# EAGLE design DCDCHalfBridgeFinished (EAGLE 7.5.0)

## Sheet 1 of 2
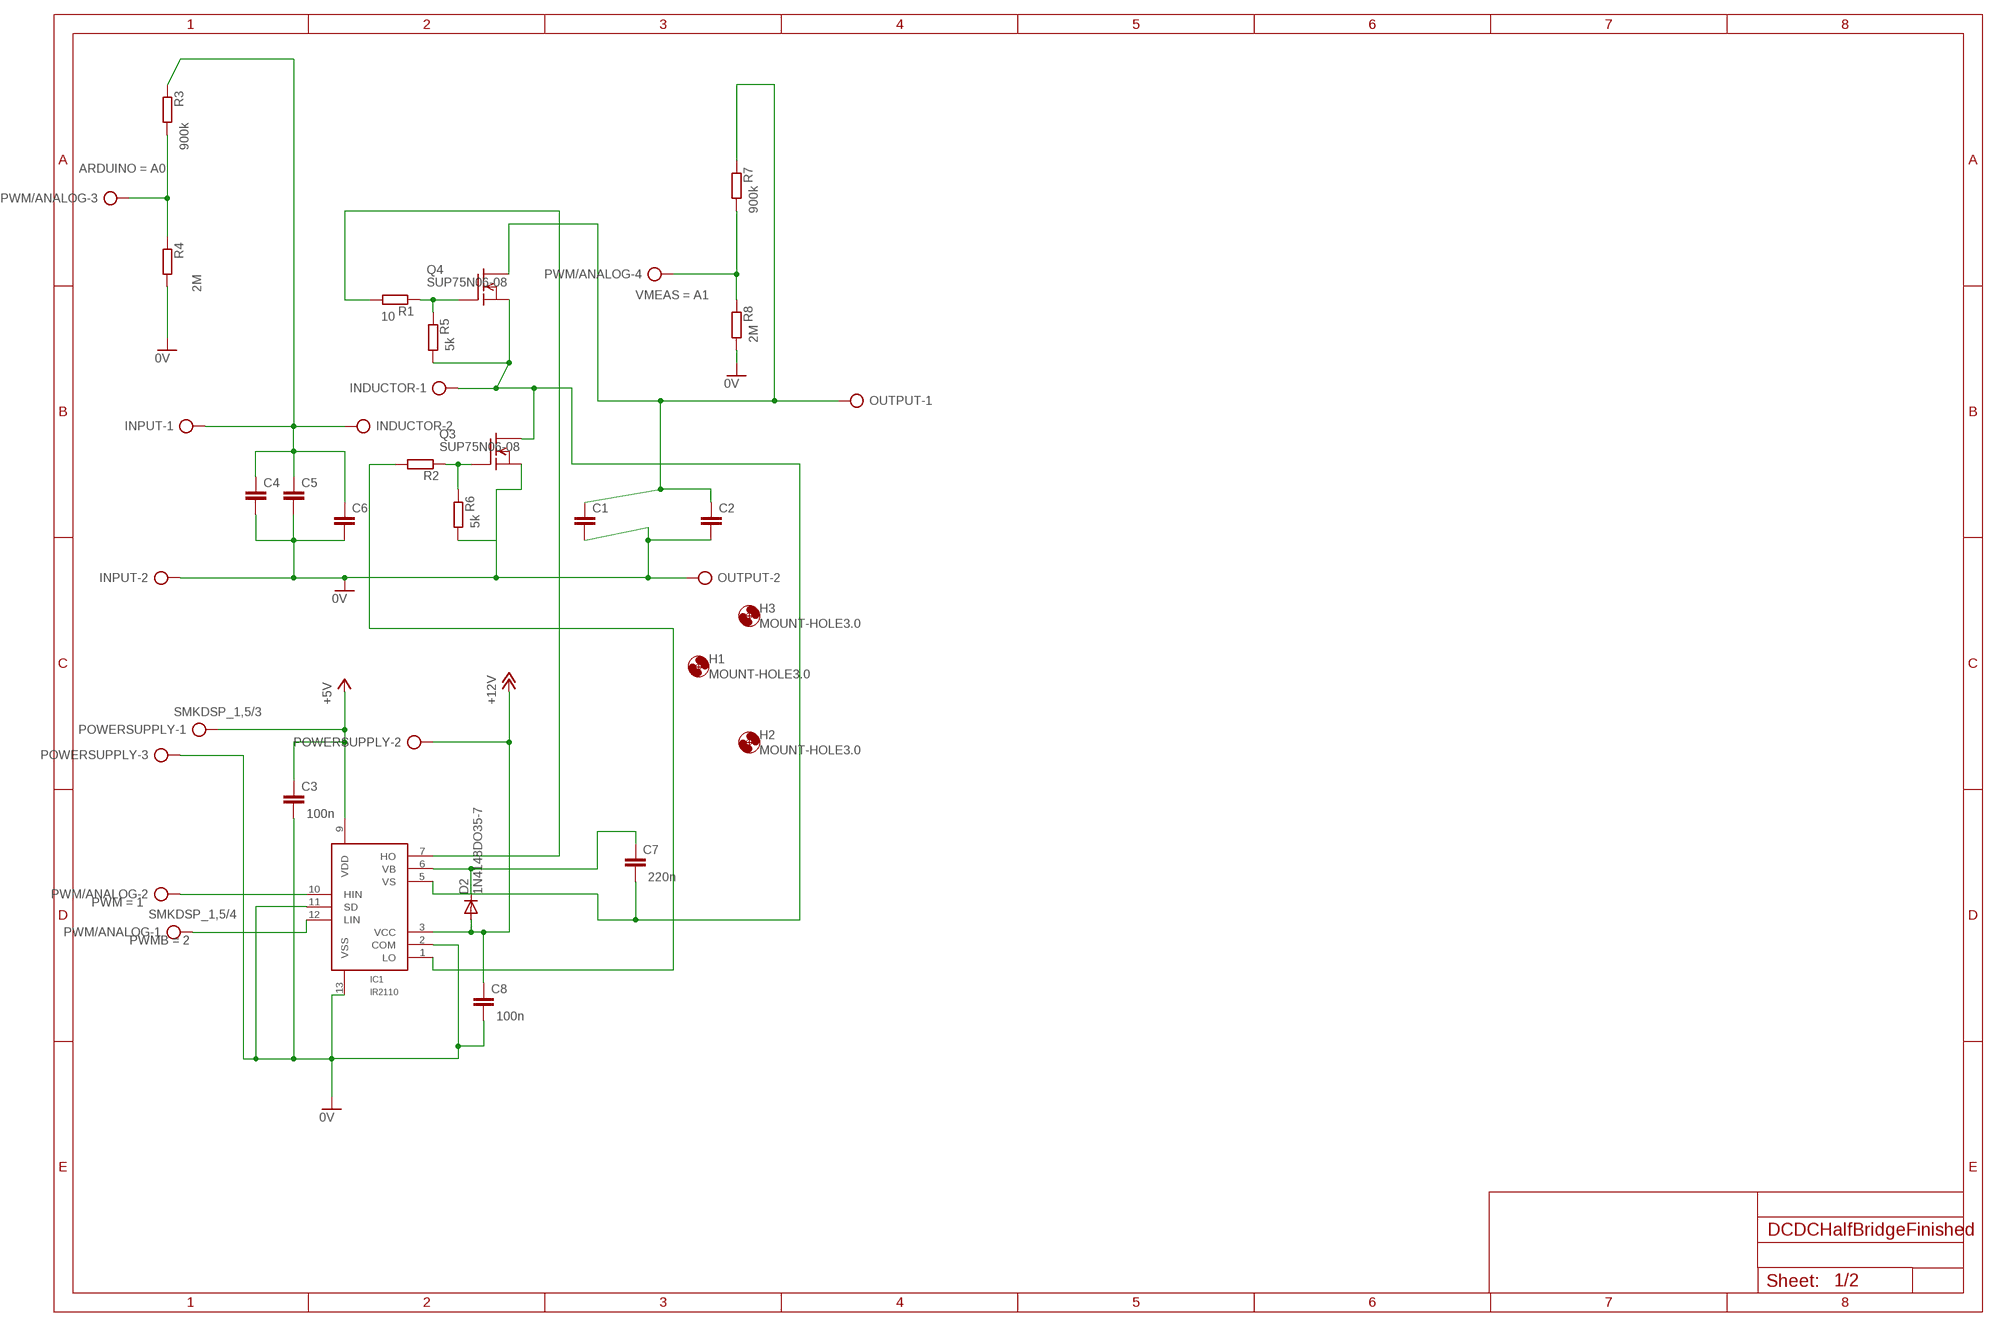
[diagram p0: schematic, sheet 1]

### Parts
C1  C-EU050-025X075  [C050-025X075]
C2  C-EU050-025X075  [C050-025X075]
C3  C-EU025-025X050  [C025-025X050]
C4  C-EU050-025X075  [C050-025X075]
C5  C-EU050-025X075  [C050-025X075]
C6  C-EU050-025X075  [C050-025X075]
C7  C-EU025-025X050  [C025-025X050]
C8  C-EU025-025X050  [C025-025X050]
D2  1N4148DO35-7  [DO35-7]
H1  MOUNT-HOLE3.0  [3,0]
H2  MOUNT-HOLE3.0  [3,0]
H3  MOUNT-HOLE3.0  [3,0]
IC1  IR2110  [DIL14]
INDUCTOR  AK300/2  [AK300/2]
INPUT  AK300/2  [AK300/2]
OUTPUT  AK300/2  [AK300/2]
POWERSUPPLY  SMKDSP_1,5/3  [SMKDSP_1,5/3]
PWM/ANALOG  SMKDSP_1,5/4  [SMKDSP_1,5/4]
Q3  SUP75N06-08  [TO220]
Q4  SUP75N06-08  [TO220]
R1  R-EU_0204/7  [0204/7]
R2  R-EU_0204/7  [0204/7]
R3  R-EU_0204/7  [0204/7]
R4  R-EU_0204/7  [0204/7]
R5  R-EU_0204/7  [0204/7]
R6  R-EU_0204/7  [0204/7]
R7  R-EU_0204/7  [0204/7]
R8  R-EU_0204/7  [0204/7]

### Nets
+5V: C3.1 IC1.9(VDD) POWERSUPPLY.1
+12V: C8.1 D2.A IC1.3(VCC) POWERSUPPLY.2
GND: C1.2 C2.2 C3.2 C4.2 C5.2 C6.2 C8.2 IC1.2(COM) IC1.11(SD) IC1.13(VSS) INPUT.2 OUTPUT.2 POWERSUPPLY.3 Q3.3(S) R4.2 R6.2 R8.2 ; supply symbol labelled 0V
N$1: PWM/ANALOG.3 R3.2 R4.1
N$2: IC1.12(LIN) PWM/ANALOG.1
N$3: IC1.10(HIN) PWM/ANALOG.2
N$5: C7.2 IC1.5(VS) INDUCTOR.1 Q3.2(D) Q4.3(S) R5.2
N$6: IC1.1(LO) R2.2
N$7: Q4.1(G) R1.1 R5.1
N$8: Q3.1(G) R2.1 R6.1
N$9: PWM/ANALOG.4 R7.2 R8.1
N$10: C7.1 D2.C IC1.6(VB)
N$11: C1.1 C2.1 OUTPUT.1 Q4.2(D) R7.1
N$12: IC1.7(HO) R1.2
N$13: C4.1 C5.1 C6.1 INDUCTOR.2 INPUT.1 R3.1

## Sheet 2 of 2: 1
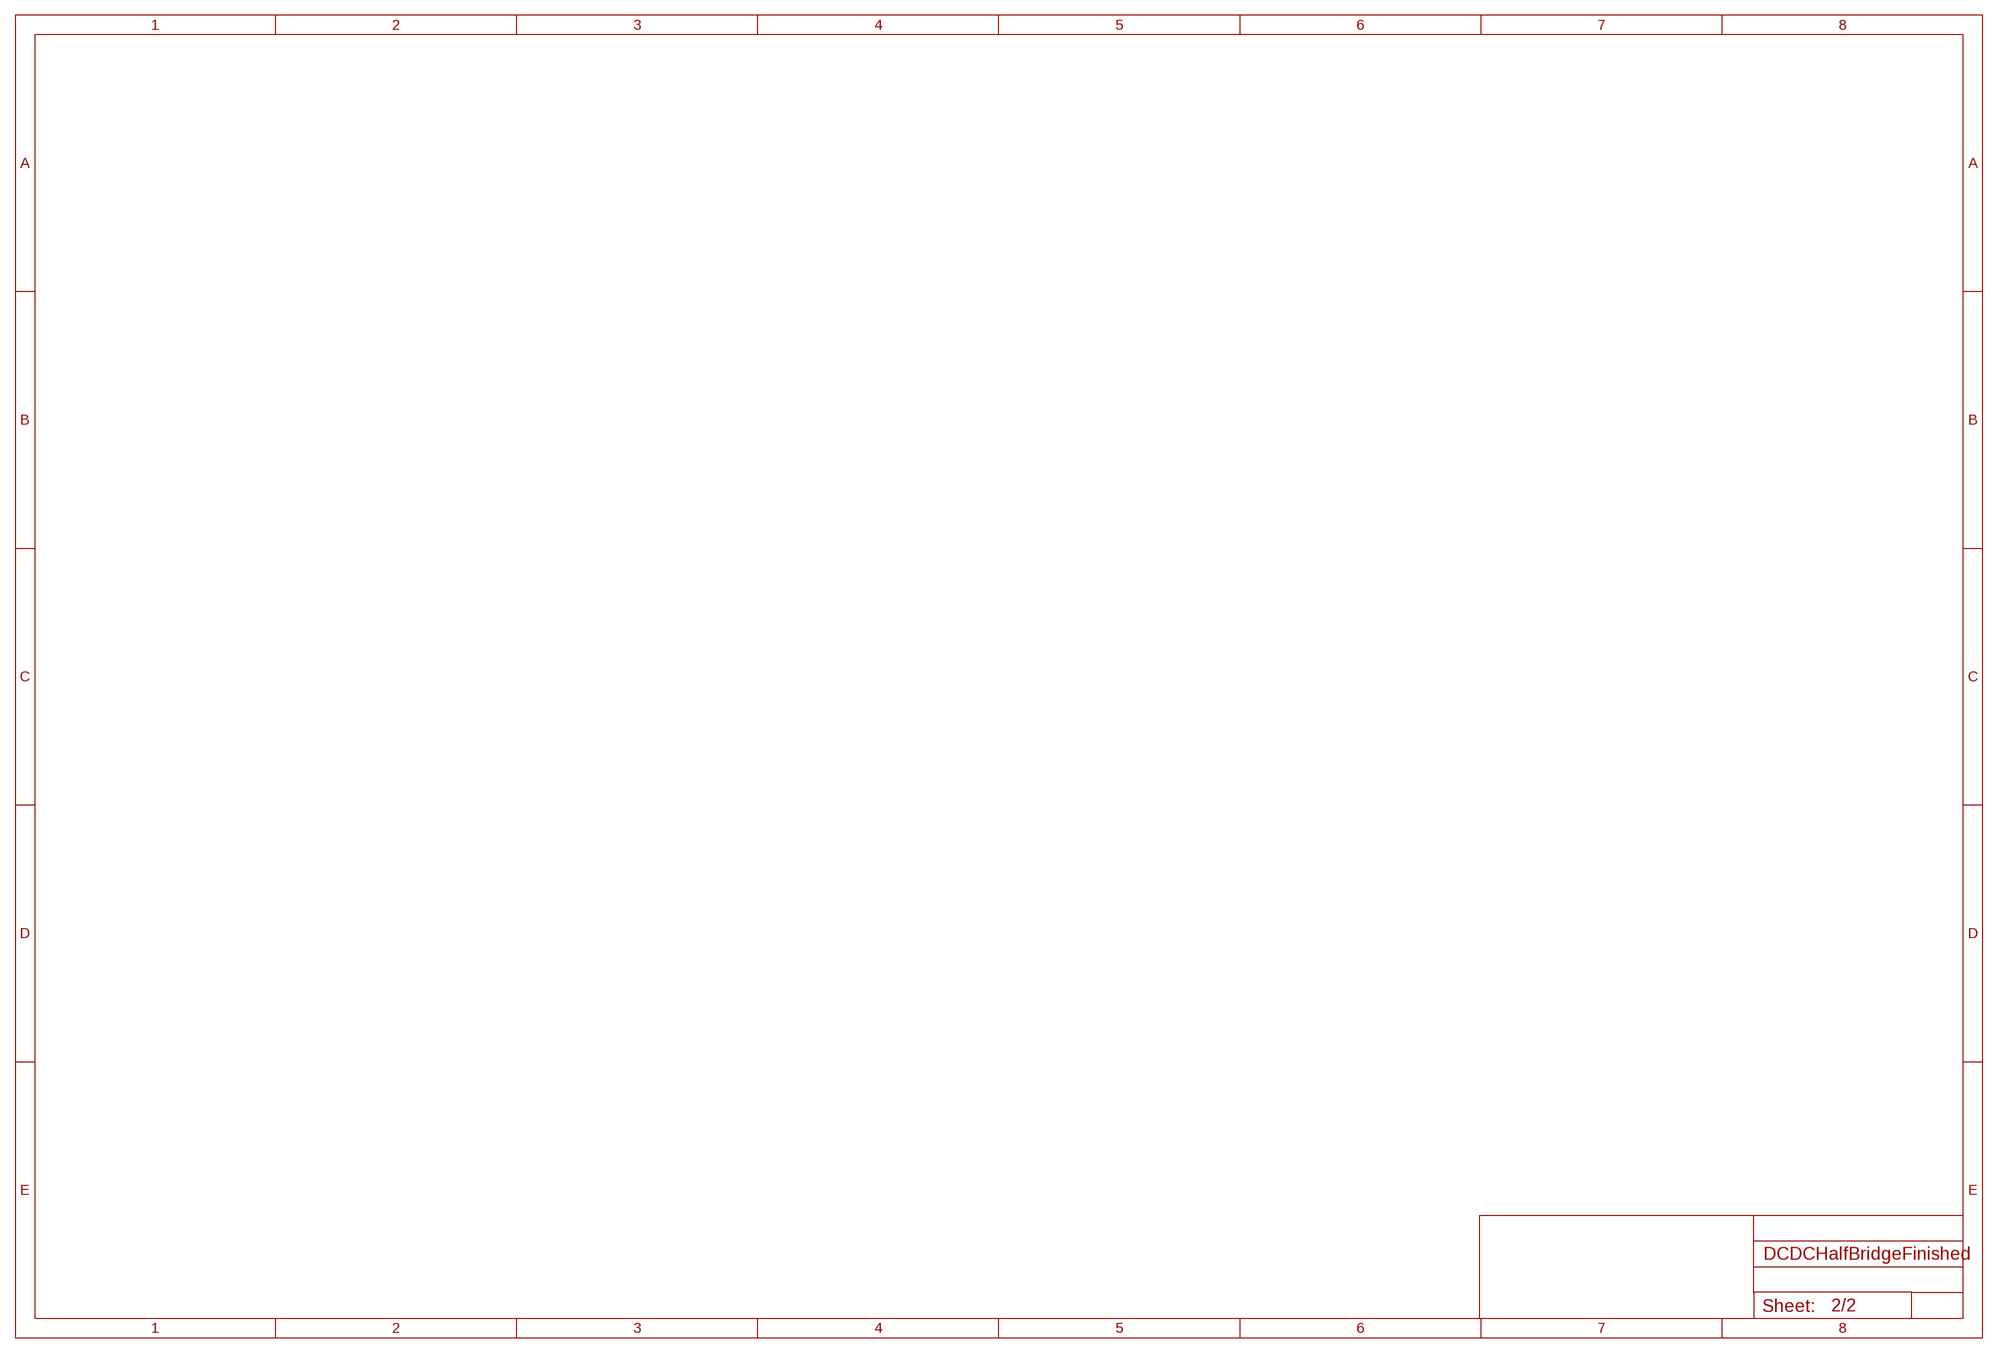
[diagram p1: schematic, sheet 2]

## Library data of the parts
C1 C2 C4-C6 = 0_OO21_power:C-EU: CAPACITOR, European symbol
C3 C8 = 0_OO21_power:C-EU: CAPACITOR, European symbol; C3: 100n
C7 = 0_OO21_power:C-EU: CAPACITOR, European symbol; C4: 220n
D2 = diode:1N4148: DIODE high speed (Philips)
H1-H3 = 0_OO21_power:MOUNT-HOLE: MOUNTING HOLE with drill center marker
IC1 = 0_OO21_power:IR2110
INDUCTOR INPUT OUTPUT = con-ptr500:AK300/2: CONNECTOR; OC_FARNELL: unknown; OC_NEWARK: unknown
POWERSUPPLY = 0_OO21_power:SMKDSP_1,5/3: Printklemme, Nennstrom: 17,5 A, Bemessungsspannung: 250 V, Raster: 5,0 mm Source: http://eshop.phoenixcontact.de .. 1733415.pdf; MF: FARNELL; MPN: 1733583; OC_FARNELL: 3041256; OC_NEWARK: 71C4130
PWM/ANALOG = 0_OO21_power:SMKDSP_1,5/4: Printklemme, Nennstrom: 17,5 A, Bemessungsspannung: 250 V, Raster: 5,0 mm Source: http://eshop.phoenixcontact.de .. 1733415.pdf; ARDUINO: A0; MF: FARNELL; MPN: 1733596; OC_FARNELL: 3041268; OC_NEWARK: 71C4131; PWM: 1; PWMB: 2; VMEAS: A1
Q3 Q4 = transistor-fet:SUP75N06-08: N-Channel Enhancement MOSFET 60V; 75A; 0,008Ohm
R1 = 0_OO21_power:R-EU_: RESISTOR, European symbol; R1: 10
R2 = 0_OO21_power:R-EU_: RESISTOR, European symbol; R2: 10
R3 R7 = 0_OO21_power:R-EU_: RESISTOR, European symbol; R1: 900k
R4 R8 = 0_OO21_power:R-EU_: RESISTOR, European symbol; R1: 2M
R5 R6 = 0_OO21_power:R-EU_: RESISTOR, European symbol; R1: 5k

## Net classes
0 default: width 0.635 mm, drill 0.635 mm, clearance 0.3 mm

## Board
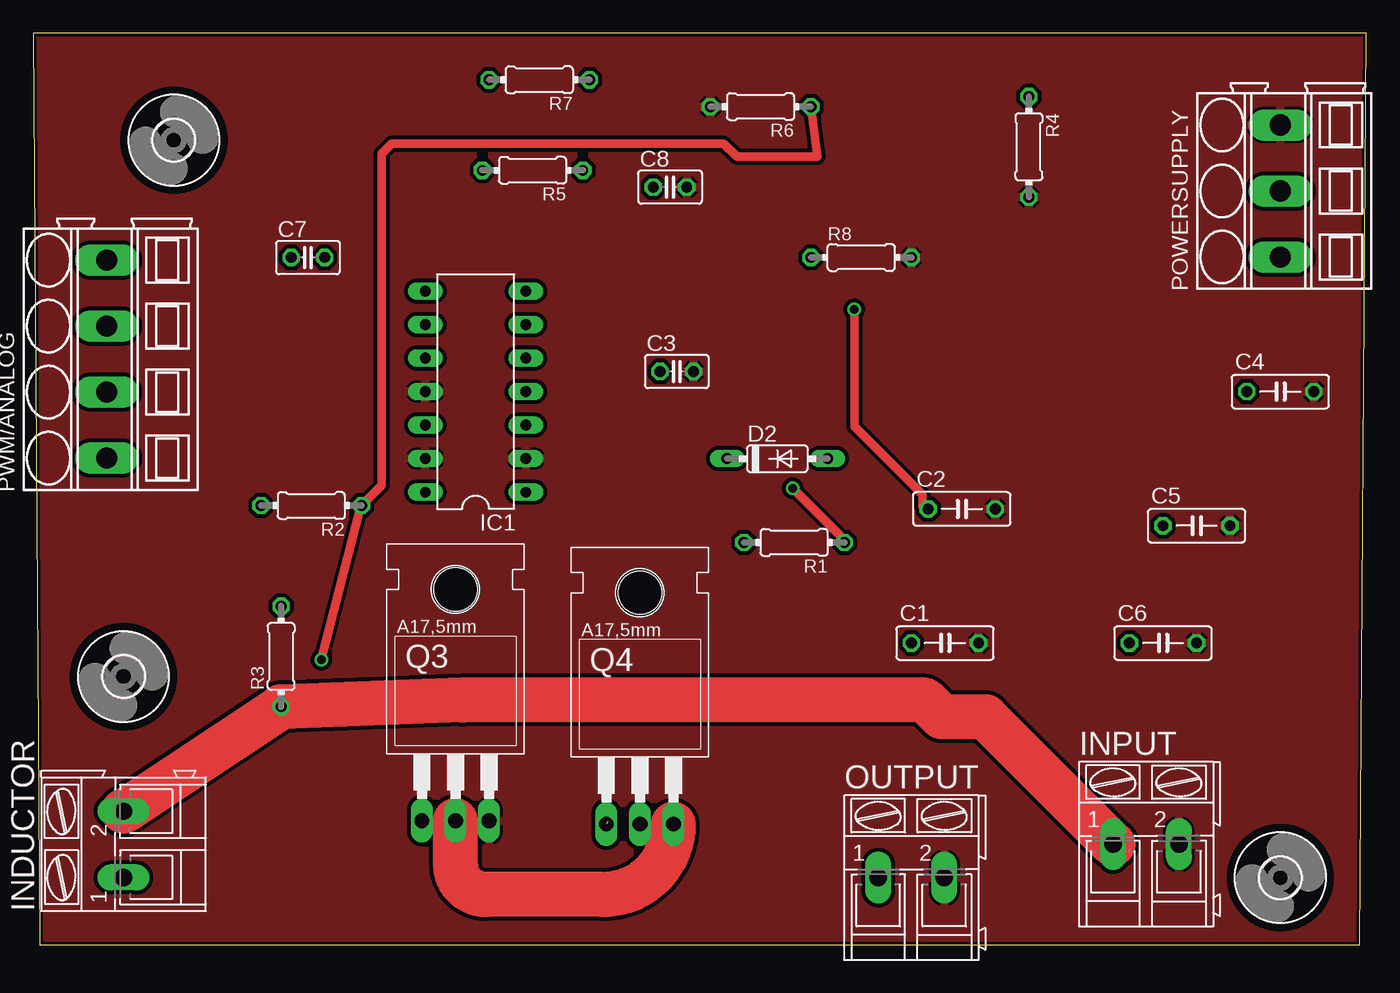
[diagram p2: board, top side]
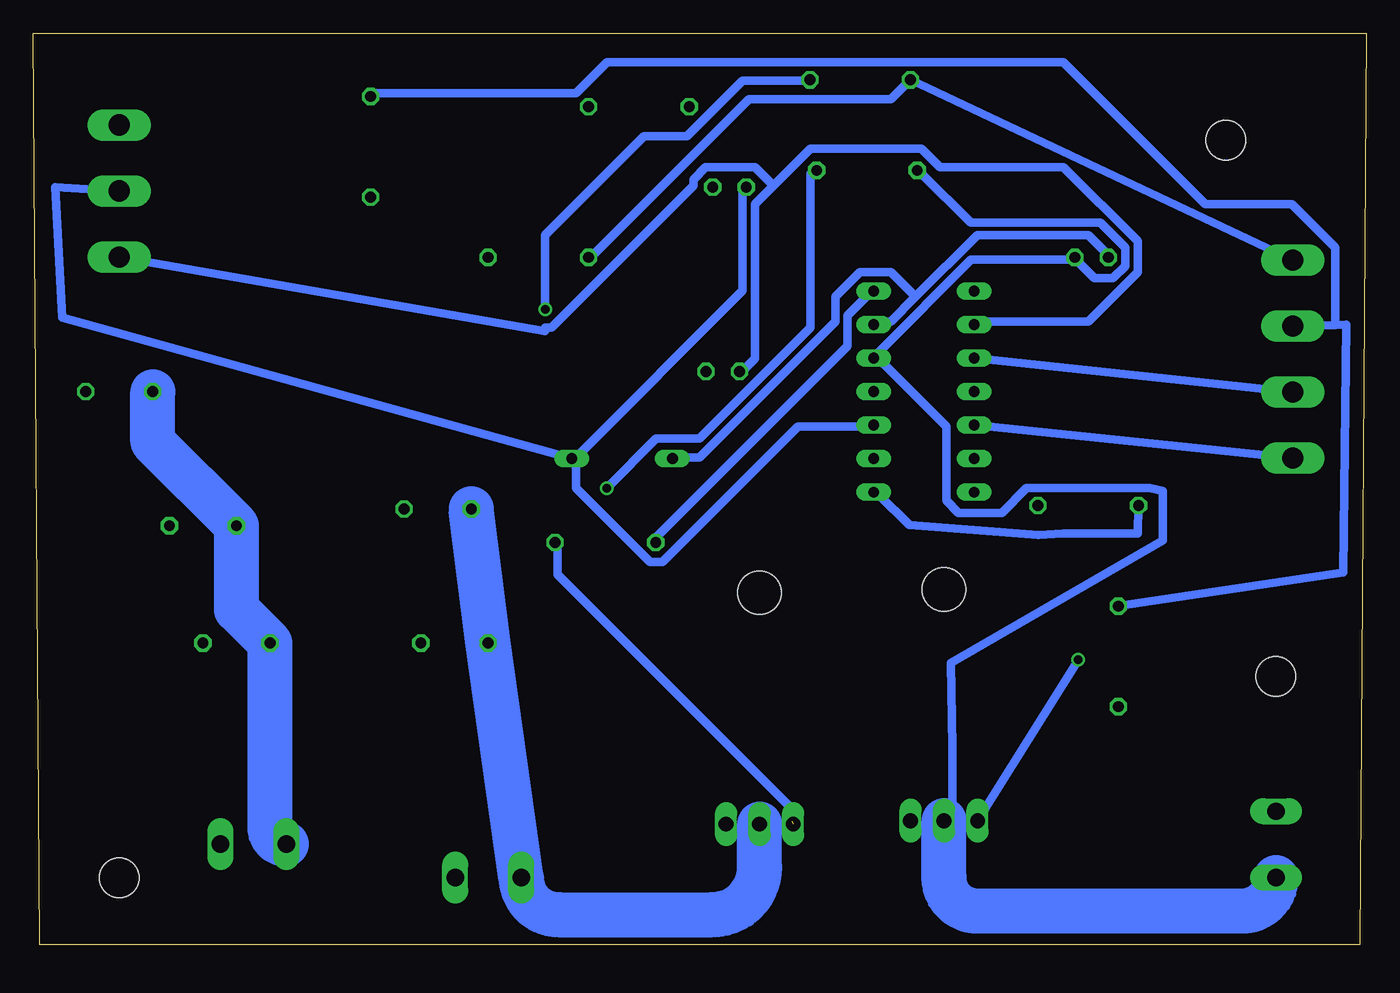
[diagram p3: board, bottom side, seen from below]

Size 101.02 x 69.08 mm. Coordinates in mm from the lower left corner, seen from the top.
Outline: 0.51,0 100.51,0 101.02,69.08 0,69.08 0.51,0
Copper layers (1*16): Top 0.105mm / dielectric 1.55mm / Bottom 0.105mm
Design rules "eC_2Layer_PClass3_BaseCopperO105": minimum track width 0.25mm, minimum drill 0.35mm, track to track 0.3mm, track to pad 0.3mm, pad to pad 0.3mm, via to via 0.3mm, smd to smd 0mil, copper to edge 0.25mm, drill to drill 0.35mm, minimum pad ring 0.25mm, minimum via ring 0.2mm, stop-mask expansion 0mil, vias tented up to drill 0.45mm, thermal gap 0.2mm

### Footprints (pad centres in the part's own frame; a part is rotated, then mirrored left to right if it is on the bottom)
C050-025X075 = drill 0.813 octagon: 1 -2.54,0; 2 2.54,0
C025-025X050 = drill 0.813 octagon: 1 -1.27,0; 2 1.27,0
DO35-7 = drill 0.813 long: A 3.81,0; C -3.81,0
3,0 = hole 3: 0,0
DIL14 = drill 0.813 long: 1 -7.62,-3.81; 2 -5.08,-3.81; 3 -2.54,-3.81; 4 0,-3.81; 5 2.54,-3.81; 6 5.08,-3.81; 7 7.62,-3.81; 8 7.62,3.81; 9 5.08,3.81; 10 2.54,3.81; 11 0,3.81; 12 -2.54,3.81; 13 -5.08,3.81; 14 -7.62,3.81
AK300/2 = drill 1.321 long: 1 -2.515,0; 2 2.489,0
SMKDSP_1,5/3 = drill 1.6 pad 1.8 long: 1 -2.5,0; 2 2.5,0; 3 7.5,0
SMKDSP_1,5/4 = drill 1.6 pad 1.8 long: 1 -2.5,0; 2 2.5,0; 3 7.5,0; 4 12.5,0
TO220 = drill 1.118 long: 1 -2.54,-6.35; 2 0,-6.35; 3 2.54,-6.35 | hole 3.302: 0,11.176
0204/7 = drill 0.813 octagon: 1 -3.81,0; 2 3.81,0

### Placement (x,y rotation side)
C1  69.09,22.86 0 top
C2  70.36,33.02 0 top
C3  48.77,43.43 0 top
C4  94.49,41.91 0 top
C5  88.14,31.75 0 top
C6  85.6,22.86 0 top
C7  20.83,52.07 0 top
C8  48.26,57.4 0 top
D2  56.39,36.83 0 top
H1  94.49,5.08 0 top
H2  10.67,60.96 0 top
H3  6.86,20.32 0 top
IC1  33.53,41.91 90 top
INDUCTOR  6.86,7.62 90 top
INPUT  84.33,7.62 0 top
OUTPUT  66.55,5.08 0 top
POWERSUPPLY  94.49,54.61 90 top
PWM/ANALOG  5.59,39.37 90 top
Q3  32,15.75 0 top
Q4  45.97,15.49 0 top
R1  57.66,30.48 180 top
R2  21.08,33.27 180 top
R3  18.8,21.84 90 top
R4  75.44,60.45 270 top
R5  37.85,58.67 180 top
R6  55.12,63.5 180 top
R7  38.35,65.53 180 top
R8  62.74,52.07 0 top

### Tracks (layer width: path | path; a pad name or v marks a point on that pad's centre or on a via)
+5V
  Bottom 0.635: POWERSUPPLY.1 62.26,46.49 | 62.26,46.49 62.23,46.48 | 44.92,57.5 46.32,56.1 46.32,44.41 47.26,43.48 C3.1 | 44.92,57.5 42.12,60.31 33.7,60.31 32.3,58.91 22.95,58.91 17.34,53.3 17.34,50.96 21.08,47.22 29.49,47.22 IC1.9 | 44.92,57.5 46.32,58.91 50.06,58.91 51,57.97 51,57.5 61.75,46.75 62.22,46.75 62.26,46.49
+12V
  Bottom 0.635: POWERSUPPLY.2 99.31,57.4 98.81,47.5 D2.A | IC1.3 37.44,39.27 43.05,39.27 53.34,28.98 54.27,28.98 59.88,34.59 59.88,36.47 D2.A | C8.1 47.26,57.03 47.26,49.55 59.88,36.93 D2.A
GND
  pour Top: -4.06,73.41 111.76,73.41 111.76,31.75 111.76,-4.32 -4.06,-4.32
N$1
  Bottom 0.635: PWM/ANALOG.3 2.37,46.97 | 2.37,46.97 1.52,46.99 1.78,28.19 R3.2 | R4.1 75.31,64.52 59.88,64.52 57.54,66.85 22.95,66.85 12.2,56.1 5.65,56.1 2.38,52.83 2.38,47.22 2.37,46.97
N$2
  Bottom 0.635: PWM/ANALOG.1 IC1.12
N$3
  Bottom 0.635: PWM/ANALOG.2 IC1.10
N$5
  Top 3.42: Q3.2 32,6.1 arc90 34.29,3.81 43.18,3.81 arc90 Q4.3
  Bottom 0.635: R5.2 33.7,58.44 29.96,54.7 20.14,54.7 18.27,52.83 18.27,51.42 19.21,50.49 20.61,50.49 22.01,51.89 C7.2 22.48,51.89 29.96,51.89 36.97,44.88 IC1.5 36.97,44.41 31.83,39.27 31.83,33.66 30.89,32.73 27.62,32.73 25.75,34.59 16.4,34.59 15.43,34.38 15.43,30.64 31.5,21.34 31.36,14.96 31.36,10.75 Q3.2
  Bottom 3.42: INDUCTOR.1 arc90 9.42,2.54 29.46,2.54 arc90 32,5.08 Q3.2
N$6
  Bottom 0.635: R2.2 17.34,31.16 22.95,31.16 24.86,31.03 34.64,31.79 36.97,34.13 IC1.1
N$7  (via drill 0.64)  (1 unrouted)
  Top 0.635: v57.54,34.59 61.28,30.86 R1.1
  Bottom 0.635: 43.52,9.35 43.52,10.29 61.28,28.05 61.28,30.39 R1.1 | v57.54,34.59 53.8,38.34 50.53,38.34 42.12,46.75 42.12,58.44 R5.1
N$8  (via drill 0.64)
  Top 0.635: 24.82,33.19 R2.1 | 24.82,33.19 26.42,34.79 26.42,59.94 27.18,60.71 52.32,60.71 53.34,59.69 59.44,59.69 R6.1 | 24.82,33.19 v21.84,21.59
  Bottom 0.635: v21.84,21.59 Q3.1
N$9
  Bottom 0.635: PWM/ANALOG.4 R7.2 34.64,65.45 36.04,64.05 46.79,64.05 58.48,52.36 R8.1
N$10
  Bottom 0.635: 34.17,49.09 29.49,53.76 21.08,53.76 19.68,52.36 C7.1 | 34.17,49.09 36.04,47.22 36.97,47.22 IC1.6 | 34.17,49.09 36.04,50.96 38.38,50.96 40.25,49.09 40.25,47.22 50.53,36.93 52.4,36.93 D2.C
N$11  (via drill 0.64)
  Top 0.635: v62.22,48.15 62.22,39.27 67.36,34.13 67.36,33.19 C2.1
  Bottom 0.635: v62.22,48.15 62.22,53.76 54.74,61.24 51.47,61.24 47.26,65.45 42.58,65.45 R7.1
  Bottom 3.42: C2.1 C1.1 OUTPUT.1 arc-90 61.24,2.29 49.53,2.29 arc-90 45.97,5.84 Q4.2
N$12
  Bottom 0.635: R1.2 53.8,30.86 39.31,45.35 39.31,47.69 37.44,49.55 IC1.7
N$13
  Top 3.42: INPUT.1 72.16,17.27 68.83,17.27 67.56,18.54 32.51,18.54 R3.1 INDUCTOR.2
  Bottom 3.42: C4.1 91.95,38.1 C5.1 85.6,25.4 C6.1 83.06,8.87 arc-90 INPUT.1